# EAGLE design 主机 Microduino v1.0 (EAGLE 6.3)
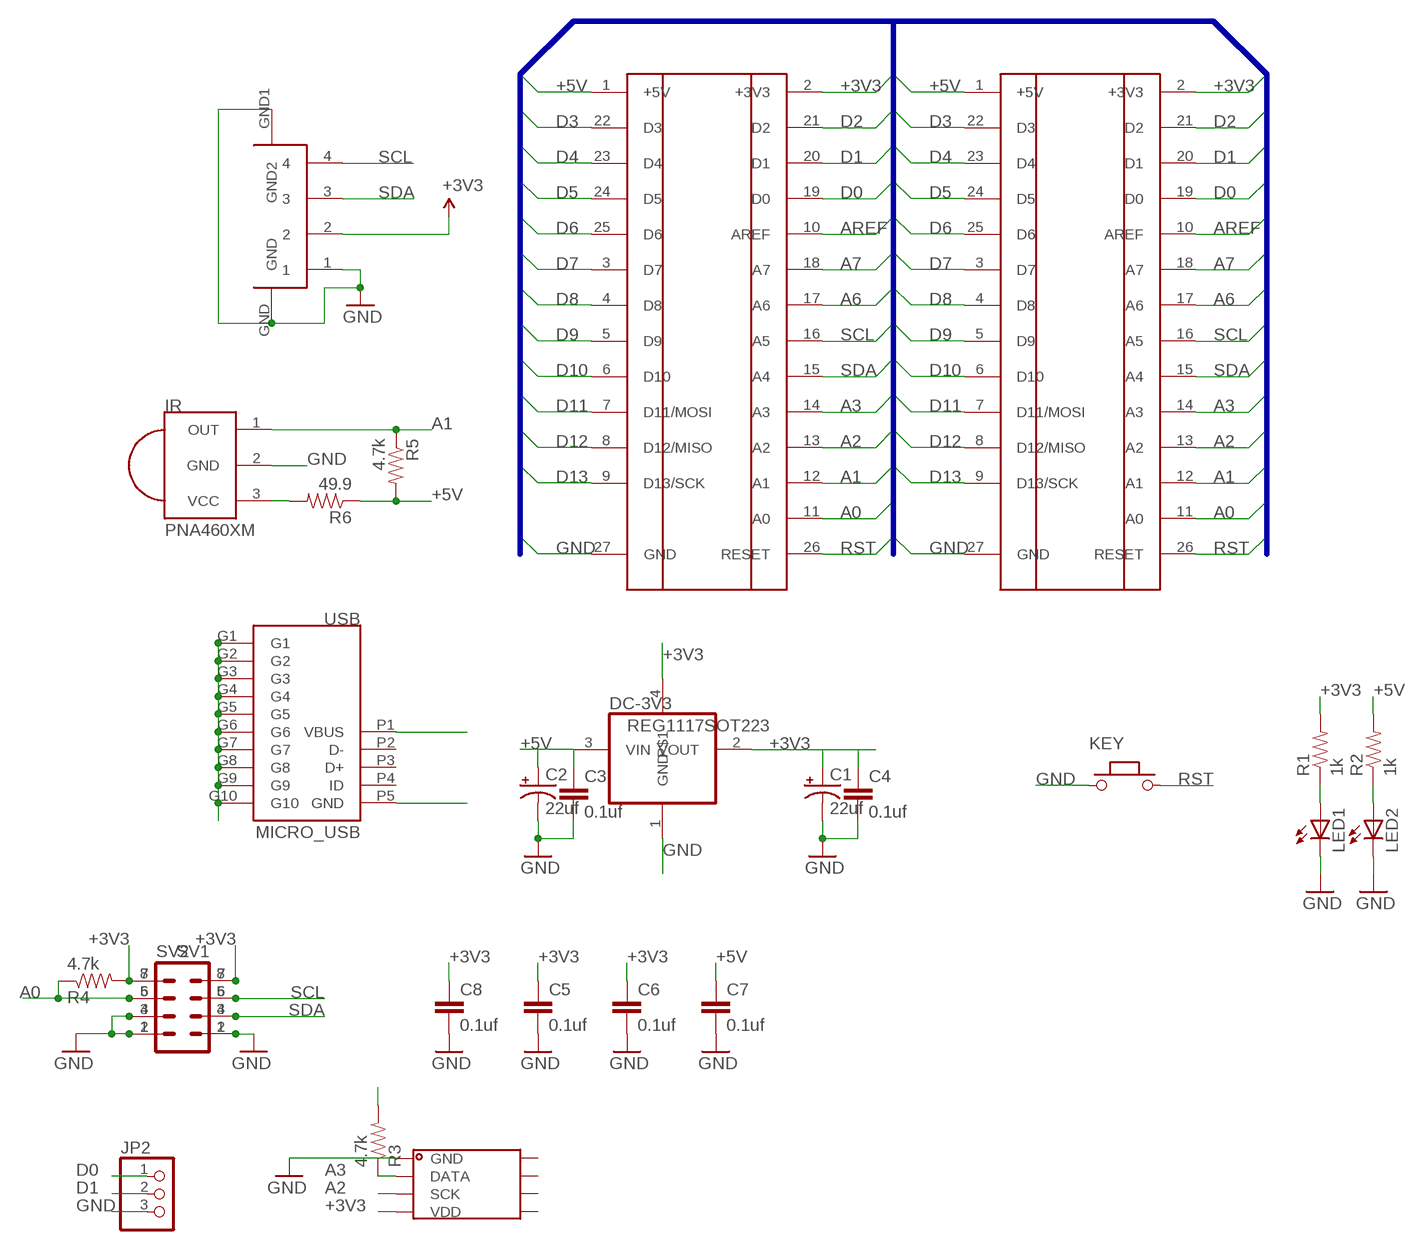
[diagram p0: schematic, sheet 1]

## Parts
C1  22uf  CAP_POL1206  [EIA3216]
C2  22uf  CAP_POL1206  [EIA3216]
C3  0.1uf  CAP0603-CAP  [0603-CAP]
C4  0.1uf  CAP0603-CAP  [0603-CAP]
C5  0.1uf  CAP0603-CAP  [0603-CAP]
C6  0.1uf  CAP0603-CAP  [0603-CAP]
C7  0.1uf  CAP0603-CAP  [0603-CAP]
C8  0.1uf  CAP0603-CAP  [0603-CAP]
DC-3V3  REG1117SOT223  [SOT223]
IR  PNA460XM  [PNA460XM]
JP2  PINHD-1X3  [1X03]
KEY  KEY-TES-018  [KEY-TS-018]
LED1  LED0805  [0805-LED]
LED2  LED0805  [0805-LED]
R1  1k  RESISTOR0603-RES  [0603-RES]
R2  1k  RESISTOR0603-RES  [0603-RES]
R3  4.7k  RESISTOR0603-RES  [0603-RES]
R4  4.7k  RESISTOR0603-RES  [0603-RES]
R5  4.7k  RESISTOR0603-RES  [0603-RES]
R6  49.9  RESISTOR0603-RES  [0603-RES]
SV1  MA04-2  [MA04-2]
SV2  MA04-2  [MA04-2]
U$1  PING-MICRDUINO/1009+  PING-MICRDUINO/1009  [PIN-MICRODUINO-1009]
U$2  PING-MICRDUINO/1009+  PING-MICRDUINO/1009  [PIN-MICRODUINO-1009]
U$3  S4B-XH-SM4-TB  [XH-SM4-TB]
U$4  SHT11  [SHT11]
USB  MICRO_USB  [MICRO_USB_LJ]

## Nets
+3V3: C1.A(+) C4.1 C5.1 C6.1 C8.1 DC-3V3.2(VOUT) DC-3V3.4 R1.2 R3.2 R4.2 SV1.7 SV1.8 SV2.7 SV2.8 U$1.2(+3V3) U$2.2(+3V3) U$3.2 U$4.4(VDD)
+5V: C2.A(+) C3.1 C7.1 DC-3V3.3(VIN) R2.2 R5.2 R6.1 U$1.1(+5V) U$2.1(+5V) USB.P1(VBUS)
A0: R4.1 SV1.5 SV2.6 U$1.11(A0) U$2.11(A0)
A1: IR.1(OUT) R5.1 U$1.12(A1) U$2.12(A1)
A2: U$1.13(A2) U$2.13(A2) U$4.3(SCK)
A3: R3.1 U$1.14(A3) U$2.14(A3) U$4.2(DATA)
A6: U$1.17(A6) U$2.17(A6)
A7: U$1.18(A7) U$2.18(A7)
AREF: U$1.10(AREF) U$2.10(AREF)
D0: JP2.1 U$1.19(D0) U$2.19(D0)
D1: JP2.2 U$1.20(D1) U$2.20(D1)
D2: U$1.21(D2) U$2.21(D2)
D3: U$1.22(D3) U$2.22(D3)
D4: U$1.23(D4) U$2.23(D4)
D5: U$1.24(D5) U$2.24(D5)
D6: U$1.25(D6) U$2.25(D6)
D7: U$1.3(D7) U$2.3(D7)
D8: U$1.4(D8) U$2.4(D8)
D9: U$1.5(D9) U$2.5(D9)
D10: U$1.6(D10) U$2.6(D10)
D11: U$1.7(D11/MOSI) U$2.7(D11/MOSI)
D12: U$1.8(D12/MISO) U$2.8(D12/MISO)
D13: U$1.9(D13/SCK) U$2.9(D13/SCK)
GND: C1.C(-) C2.C(-) C3.2 C4.2 C5.2 C6.2 C7.2 C8.2 DC-3V3.1(GND) IR.2(GND) JP2.3 KEY.2 LED1.C LED2.C SV1.1 SV1.2 SV1.3 SV2.1 SV2.2 SV2.4 U$1.27(GND) U$2.27(GND) U$3.1 U$3.GND U$3.GND1(GND2) U$4.1(GND) USB.G1 USB.G2 USB.G3 USB.G4 USB.G5 USB.G6 USB.G7 USB.G8 USB.G9 USB.G10 USB.P5(GND)
N$2: IR.3(VCC) R6.2
N$7: LED1.A R1.1
N$11: LED2.A R2.1
RST: KEY.1 U$1.26(RESET) U$2.26(RESET)
SCL: SV1.6 SV2.5 U$1.16(A5) U$2.16(A5) U$3.4
SDA: SV1.4 SV2.3 U$1.15(A4) U$2.15(A4) U$3.3
Unconnected: U$4.P$5 U$4.P$6 U$4.P$7 U$4.P$8 USB.P2(D-) USB.P3(D+) USB.P4(ID)

## Buses
B$1

## Library data of the parts
C1 C2 = microduino:CAP_POL: Capacitor Polarized These are standard SMD and PTH capacitors. Normally 10uF, 47uF, and 100uF in electrolytic and tantalum varieties. Always verify the external diameter of the through hole cap, it varies with capacity, voltage, and manufacturer. The EIA devices should be standard.
C3-C8 = microduino:CAP: Capacitor Standard 0603 ceramic capacitor, and 0.1" leaded capacitor.
DC-3V3 = 00my:REG1117
IR = adafruit:PNA460XM: IR 38KHz receiver PNA4602 and related receivers http://www.ladyada.net/library/pcb/eaglelibrary.html
JP2 = pinhead:PINHD-1X3: PIN HEADER
KEY = 00my:KEY
LED1 LED2 = 00my:LED: LEDs Standard schematic elements and footprints for 5mm, 3mm, 1206, and 0603 sized LEDs. 5mm - Spark Fun Electronics SKU : COM-00529 (and others)
R1 R2 = 00my:RESISTOR: Resistor Basic schematic elements and footprints for 0603, 1206, and PTH 1/10th watt (small) resistors.
R3-R6 = MY:RESISTOR: Resistor Basic schematic elements and footprints for 0603, 1206, and PTH 1/10th watt (small) resistors.
SV1 SV2 = pkj:MA04-2: PIN HEADER; OC_FARNELL: unknown; OC_NEWARK: unknown
U$1 U$2 = MY:PING-MICRDUINO: microduino引脚封装
U$3 = microduino:S4B-XH
U$4 = pkj:SHT11
USB = microduino:MICRO_USB

## Net classes
1 power: width 0.381 mm

## Board
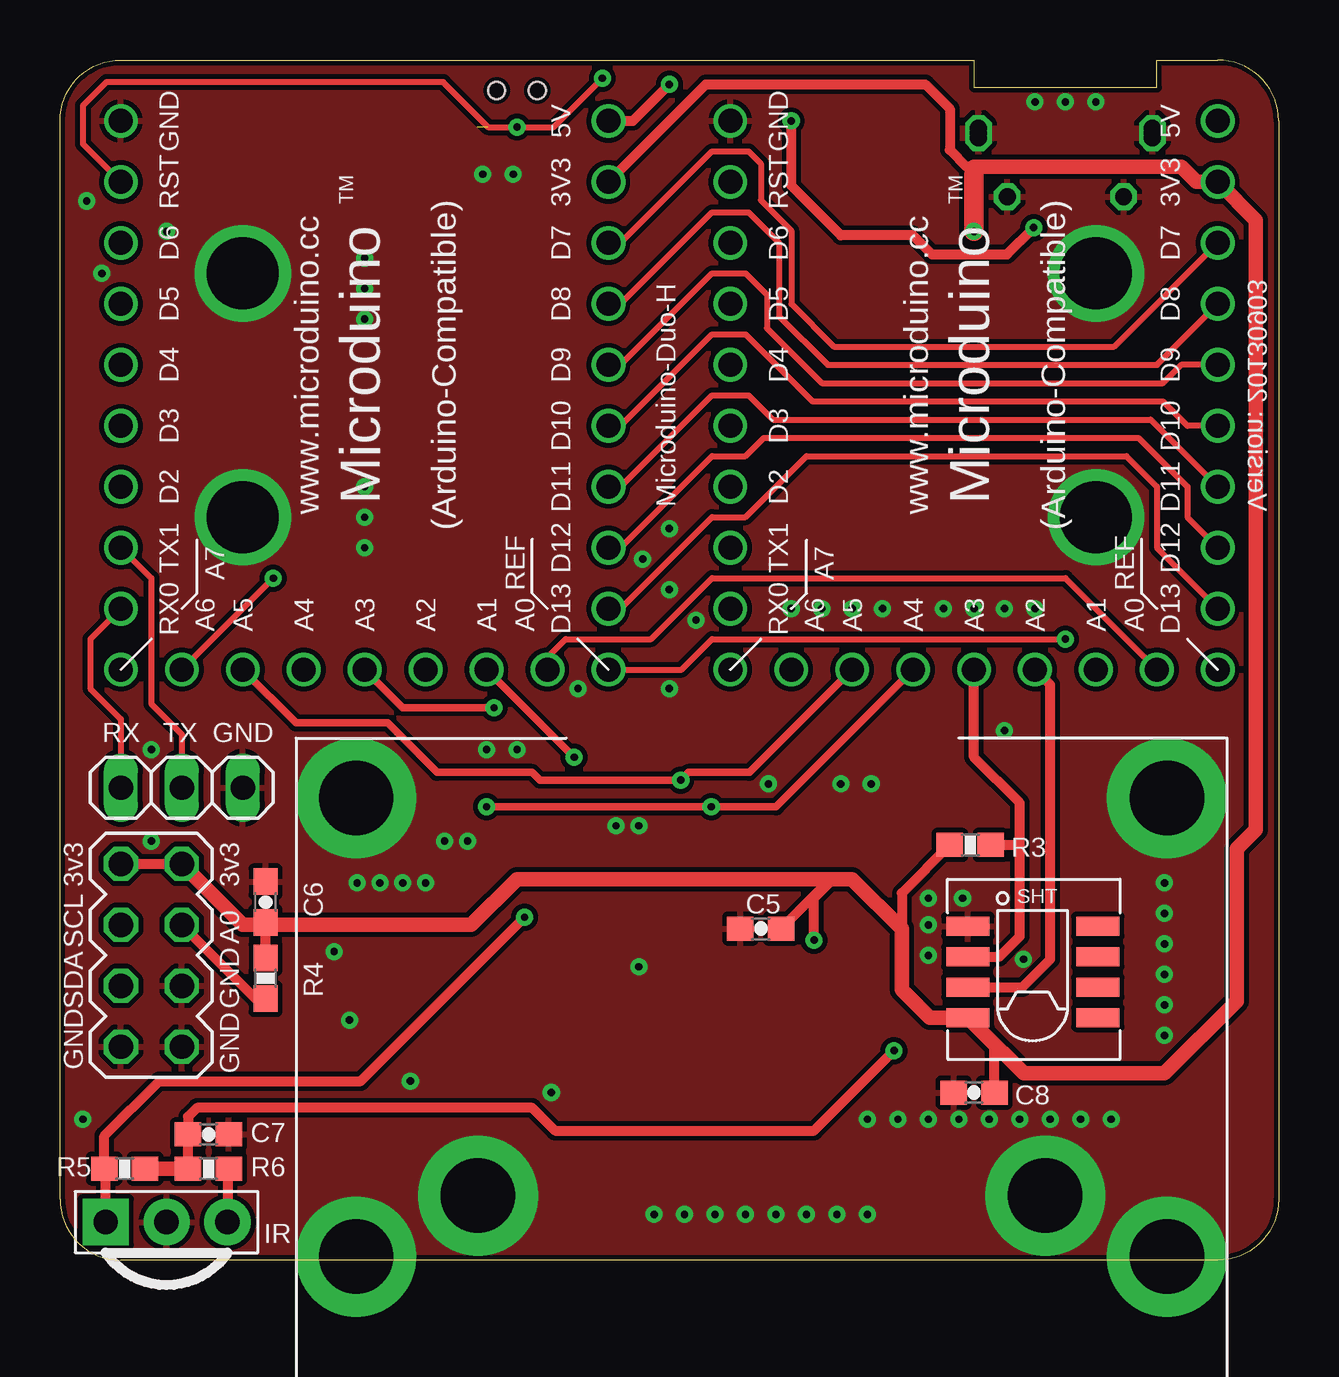
[diagram p1: board, top side]
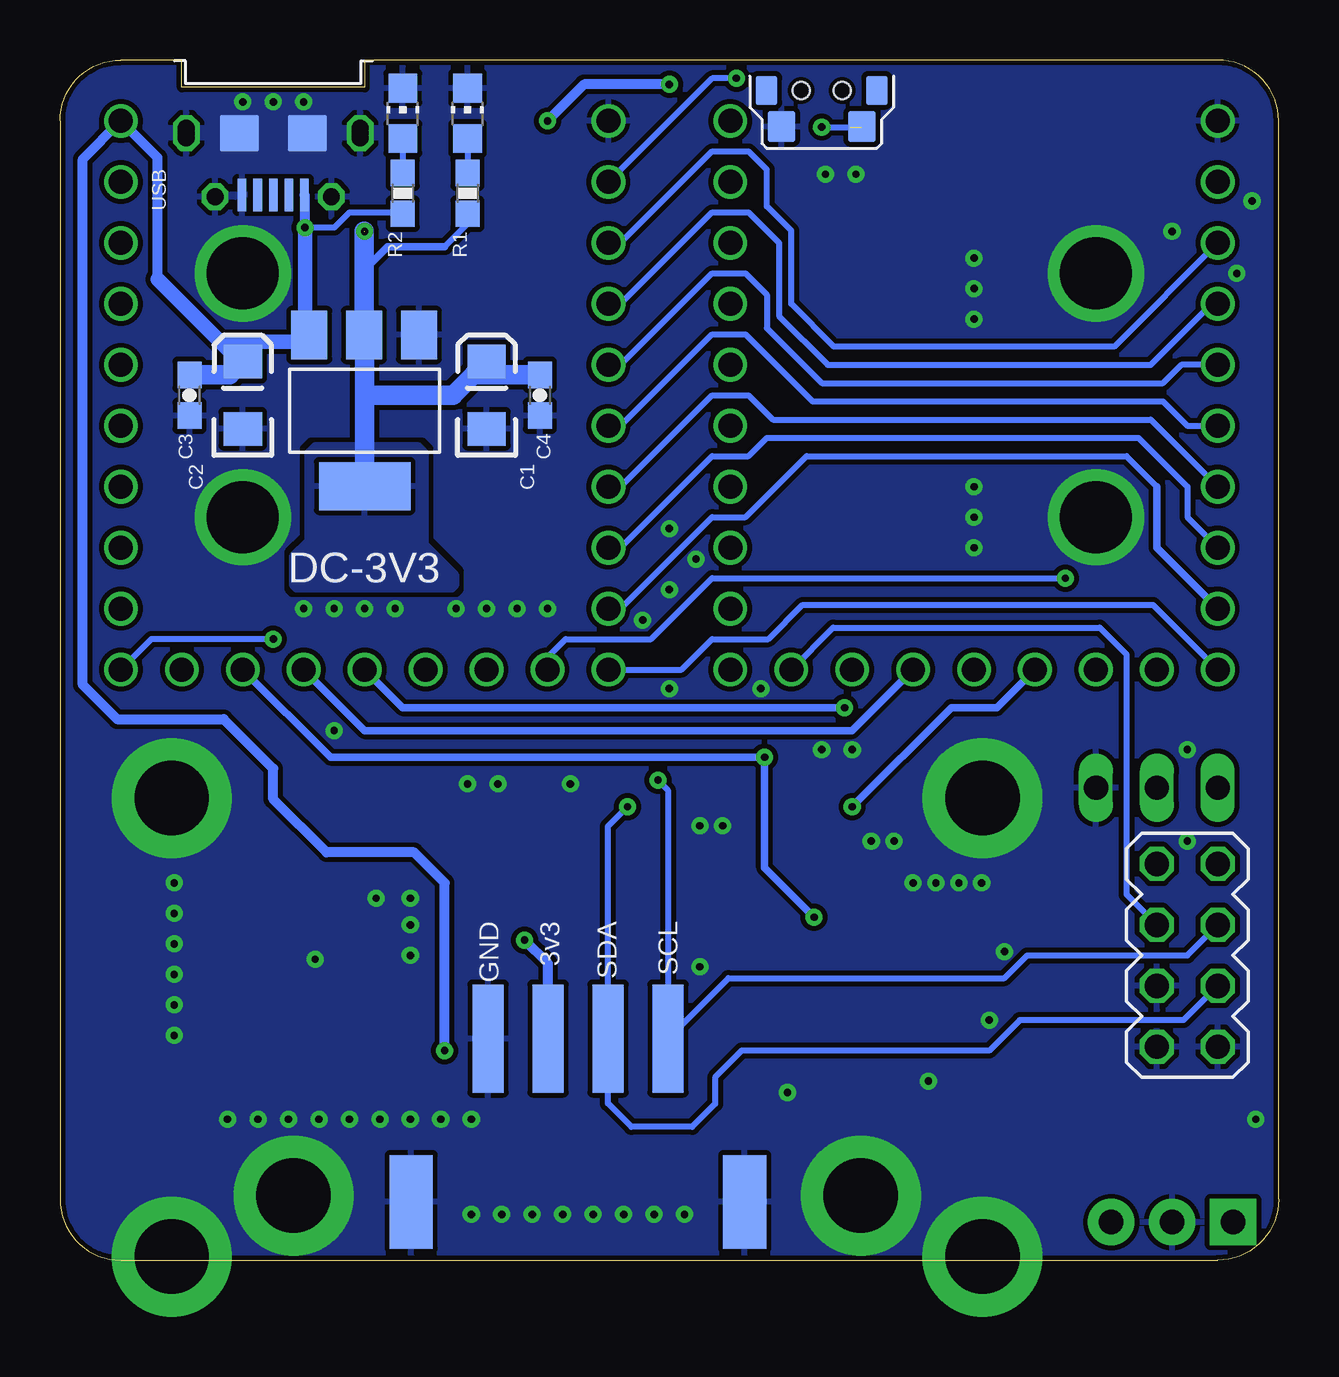
[diagram p2: board, bottom side, seen from below]

Size 50.8 x 50.01 mm. Coordinates in mm from the lower left corner, seen from the top.
Outline: 0,2.54 0,47.47 arc-90 2.54,50.01 38.1,50.01 38.1,48.86 45.72,48.86 45.72,50.01 48.26,50.01 arc-90 50.8,47.47 50.8,2.54 arc-90 48.26,0 2.54,0 arc-90 0,2.54
Copper layers (1*16): Top 0.035mm / dielectric 1.5mm / Bottom 0.035mm
Design rules "3d1": minimum track width 8mil, minimum drill 2mil, track to track 8mil, track to pad 8mil, pad to pad 8mil, via to via 8mil, smd to smd 0mil, copper to edge 8mil, drill to drill 8mil, minimum pad ring 8mil, minimum via ring 8mil, stop-mask expansion 2mil, vias tented up to drill 2mil, thermal gap 8mil

### Footprints (pad centres in the part's own frame; a part is rotated, then mirrored left to right if it is on the bottom)
EIA3216 = smd 1.4 x 1.6: A 1.4,0; C -1.4,0
0603-CAP = smd 1.1 x 1: 1 -0.85,0; 2 0.85,0
SOT223 = smd 1.499 x 2.007: 1 -2.261,-3.15; 2 0.025,-3.15; 3 2.311,-3.15 | smd 3.81 x 2.007: 4 0,3.15
PNA460XM = drill 1.016 pad 1.93 square: 1 -2.54,0 | drill 1.016 pad 1.93: 2 0,0; 3 2.54,0
1X03 = drill 1.016 long: 1 -2.54,0; 2 0,0; 3 2.54,0
KEY-TS-018 = smd 1.15 x 1.3: 1 1.675,-1.505; 2 -1.675,-1.505 | smd 0.9 x 1.2: 3 -2.3,0; 4 2.3,0 | hole 0.7: -0.85,0; 0.85,0
0805-LED = smd 1.2 x 1.2: A 0,-1.05; C 0,1.05
0603-RES = smd 1.1 x 1: 1 -0.85,0; 2 0.85,0
MA04-2 = drill 1.016 octagon: 1 -3.81,-1.27; 2 -3.81,1.27; 3 -1.27,-1.27; 4 -1.27,1.27; 5 1.27,-1.27; 6 1.27,1.27; 7 3.81,-1.27; 8 3.81,1.27
PIN-MICRODUINO-1009 = drill 1: 1 2.54,2.54; 2 5.08,2.54; 3 7.62,2.54; 4 10.16,2.54; 5 12.7,2.54; 6 15.24,2.54; 7 17.78,2.54; 8 20.32,2.54; 9 22.86,2.54; 10 25.4,2.54; 11 25.4,5.08; 12 25.4,7.62; 13 25.4,10.16; 14 25.4,12.7; 15 25.4,15.24; 16 25.4,17.78; 17 25.4,20.32; 18 25.4,22.86; 19 22.86,22.86; 20 20.32,22.86; 21 17.78,22.86; 22 15.24,22.86; 23 12.7,22.86; 24 10.16,22.86; 25 7.62,22.86; 26 5.08,22.86; 27 2.54,22.86
XH-SM4-TB = smd 1.3 x 4.5: 1 -3.75,8.75; 2 -1.25,8.75; 3 1.25,8.75; 4 3.75,8.75 | smd 1.8 x 3.9: GND -6.95,1.95; GND1 6.95,1.95
SHT11 = smd 1.8 x 0.8: 1 -6.445,-1.96; 2 -6.445,-3.23; 3 -6.445,-4.5; 4 -6.445,-5.77; P$5 -1.03,-5.77; P$6 -1.03,-4.5; P$7 -1.03,-3.23; P$8 -1.03,-1.96
MICRO_USB_LJ = drill 0.7 octagon: G1 -3.625,0.2; G2 -3.625,0; G3 -3.625,-0.2; G4 3.625,0.2; G5 3.625,0; G6 3.625,-0.2; G7 -2.425,2.65; G8 2.425,2.65 | smd 1.626 x 1.524: G9 -1.416,0; G10 1.416,0 | smd 0.4 x 1.35: P1 -1.3,2.575; P2 -0.65,2.575; P3 0,2.575; P4 0.65,2.575; P5 1.3,2.575

### Placement (x,y rotation side)
C1  33.02,36.04 90 bottom
C2  43.18,36.04 90 bottom
C3  45.4,36.04 270 bottom
C4  30.8,36.04 270 bottom
C5  29.21,13.81 180 top
C6  8.57,14.92 90 top
C7  6.19,5.24 0 top
C8  38.1,6.98 180 top
DC-3V3  38.1,35.4 180 bottom
IR  4.44,1.59 0 top
JP2  5.08,19.68 0 top
KEY  19.05,48.74 0 bottom
LED1  33.81,47.78 0 bottom
LED2  36.51,47.78 0 bottom
R1  33.81,44.45 270 bottom
R2  36.51,44.45 270 bottom
R3  37.94,17.3 180 top
R4  8.57,11.75 90 top
R5  2.7,3.81 0 top
R6  6.19,3.81 0 top
SV1  3.81,12.7 90 top
SV2  3.81,12.7 90 bottom
U$1  50.8,50.01 270 bottom
U$2  25.4,50.01 270 bottom
U$3  29.21,0.48 0 bottom
U$4  44.29,15.88 0 top
USB  41.91,46.96 180 bottom

### Tracks (layer width: path | path; a pad name or v marks a point on that pad's centre or on a via)
+3V3  (via drill 0.3)  (1 unrouted)
  Top 0.406: U$2.2 26.92,48.99 36.07,48.99 37.08,47.97 37.08,46.26 37.78,45.56 38.1,45.56 | SV1.8 SV1.7 | R4.2 C6.1 8.26,14.07 8.26,13.97 | C5.1 32.12,15.88 32.23,15.88 31.43,15.08 v31.43,13.34 | R3.2 35.08,15.3 35.08,12.54 | C8.1 38.95,9 38.34,9.61
  Top 0.61: 38.1,45.24 38.1,45.56 46.74,45.56 47.37,44.93 U$1.2 49.85,43.34 49.85,17.94 49.05,17.15 49.05,10.8 46.04,7.78 40.17,7.78 38.34,9.61 U$4.4 36.25,10.11 35.08,11.27 35.08,12.54 35.08,13.81 33.02,15.88 32.23,15.88 19.05,15.88 17.14,13.97 8.26,13.97 7.62,13.97 SV1.7
  Top 0.813: v38.1,42.86 38.1,45.24
  Bottom 0.254: R1.2 33.81,43.18 34.77,42.23
  Bottom 0.305: 34.77,42.23 37.15,42.23 37.94,41.43 38.12,41.43
  Bottom 0.406: DC-3V3.2 38.1,38.55 | U$3.2 30.46,12.36 v31.43,13.34
  Bottom 0.813: DC-3V3.2 38.12,41.43 38.12,42.86 | 38.1,38.55 38.1,36.04 | 38.1,36.04 DC-3V3.4 | C4.1 33.57,36.89 | C1.A 33.57,36.89 | 33.57,36.89 34.42,36.04 38.1,36.04
  pour Bottom (isolate 0.305, rank 5): 40.16,33.97 35.88,33.97 35.56,33.66 35.56,29.85 34.29,28.57 34.29,28.1 34.45,27.94 40.96,27.94 41.12,28.1 41.12,29.37 40.48,30 40.48,33.66
+5V  (via drill 0.3)
  Top 0.406: U$2.1 23.88,47.47 v25.4,48.99 | v40.59,43.02 39.48,41.91 36.35,41.91 35.56,42.7 32.54,42.7 30.48,44.77 v30.48,47.47 | R6.1 C7.1 5.34,5.98 5.71,6.35 19.68,6.35 20.64,5.4 31.43,5.4 v34.77,8.73
  Top 0.61: R6.1 R5.2
  Bottom 0.254: v40.59,43.02 39.37,43.02 38.73,43.66 37.05,43.66 R2.2
  Bottom 0.406: 46.74,40.86 46.74,45.94 U$1.1 49.85,45.88 49.85,23.97 48.42,22.54 43.97,22.54 41.91,20.48 41.91,19.21 39.69,16.99 36.04,16.99 34.77,15.72 v34.77,8.73 | 40.59,38.73 DC-3V3.3 | v25.4,48.99 28.96,48.99 v30.48,47.47 | v40.59,43.02 40.59,44.36 USB.P1
  Bottom 0.61: 44.13,38.26 46.74,40.86 | v40.59,43.02 40.59,38.73 | 44.13,38.26 40.7,38.26 DC-3V3.3 | 44.13,38.26 43.31,37.44 C2.A
  Bottom 0.813: C3.1 43.73,36.89 C2.A
A0
  Top 0.254: U$2.11 20.32,25.11 21.08,25.88 24.64,25.88 27.18,28.42 41.91,28.42 U$1.11
  Top 0.406: R4.1 8.15,10.9 SV1.5
  Bottom 0.254: U$2.11 18.57,26.35 7.46,26.35 6.35,25.24 6.35,15.24 SV1.5
A1  (via drill 0.3)
  Top 0.305: v21.43,20.96 U$2.12
  Top 0.406: IR.1 1.91,3.75 R5.1 1.85,5.18 4.13,7.46 12.54,7.46 v19.37,14.29
  Bottom 0.305: U$1.12 39.53,20.96 v21.43,20.96 21.43,16.35 v19.37,14.29
A2
  Top 0.406: U$4.3 40.11,11.38 41.27,12.54 41.27,23.97 U$1.13
  Bottom 0.305: U$2.13 17.78,22.07 38.1,22.07 U$1.13
A3  (via drill 0.3)
  Top 0.305: v18.1,23.02 14.29,23.02 U$2.14
  Top 0.406: U$4.2 39.16,12.65 40,13.49 40,17.3 | 40,17.3 40,19.05 38.1,20.96 U$1.14 | R3.1 40,17.3
  Bottom 0.305: U$1.14 36.51,23.02 v18.1,23.02
A6  (via drill 0.3)
  Top 0.254: v8.89,28.42 U$2.17
  Bottom 0.254: U$1.17 30.48,25.11 29.72,25.88 26.16,25.88 23.62,28.42 v8.89,28.42
A7
  Bottom 0.254: U$1.18 24.89,24.61 23.62,25.88 21.27,25.88 19.84,27.31 5.24,27.31 U$2.18
AREF  (via drill 0.3)
  Top 0.254: U$2.10 25.91,24.61 27.18,25.88 v41.91,25.88
  Bottom 0.254: v41.91,25.88 46.99,25.88 U$1.10
D0
  Top 0.254: U$2.19 1.27,25.88 1.27,23.81 2.54,22.54 JP2.1
  Bottom 0.254: U$1.19 27.43,27.15 23.62,30.96 22.22,30.96 19.68,33.5 6.35,33.5 5.08,32.23
  Bottom 0.305: U$2.19 5.08,29.69 5.08,32.23
D1
  Top 0.254: U$2.20 3.81,28.42 3.81,23.18 5.08,21.91 JP2.2
  Bottom 0.254: 27.43,29.69 23.62,33.5 22.1,33.5 21.34,34.26 5.84,34.26 3.81,32.23 3.81,30.96 U$2.20
  Bottom 0.305: U$1.20 27.43,29.69
D2
  Bottom 0.254: U$1.21 27.43,32.23 23.62,36.04 22.1,36.04 21.08,35.02 5.33,35.02 U$2.21
D3
  Bottom 0.254: U$1.22 27.43,34.77 23.62,38.58 22.22,38.58 19.43,35.78 4.83,35.78 3.81,34.77 U$2.22
D4
  Bottom 0.254: U$1.23 27.43,37.31 23.62,41.12 22.22,41.12 21.34,40.23 21.34,38.83 19.05,36.54 4.83,36.54 4.06,37.31 U$2.23
D5
  Bottom 0.254: U$1.24 27.43,39.85 23.62,43.66 22.1,43.66 20.83,42.39 20.83,39.34 18.8,37.31 5.33,37.31 2.79,39.85 U$2.24
D6
  Bottom 0.254: U$1.25 27.43,42.39 23.62,46.2 22.1,46.2 21.34,45.43 21.34,43.91 20.32,42.89 20.32,39.85 18.54,38.07 6.86,38.07 U$2.25
D7
  Top 0.254: U$2.3 23.37,42.39 27.18,46.2 28.7,46.2 29.21,45.69 29.21,44.16 30.48,42.89 30.48,39.85 32.26,38.07 43.94,38.07 U$1.3
D8
  Top 0.254: U$2.4 23.37,39.85 27.18,43.66 28.7,43.66 29.97,42.39 29.97,39.34 32,37.31 45.72,37.31 U$1.4
D9
  Top 0.254: U$2.5 23.37,37.31 27.18,41.12 28.57,41.12 29.46,40.23 29.46,38.83 31.75,36.54 45.97,36.54 46.74,37.31 U$1.5
D10
  Top 0.254: U$2.6 23.37,34.77 27.18,38.58 28.57,38.58 31.37,35.78 45.97,35.78 46.99,34.77 U$1.6
D11
  Top 0.254: U$2.7 23.37,32.23 27.18,36.04 28.7,36.04 29.72,35.02 45.47,35.02 U$1.7
D12
  Top 0.254: U$2.8 23.37,29.69 27.18,33.5 28.57,33.5 29.34,34.26 44.96,34.26 46.99,32.23 46.99,30.96 U$1.8
D13
  Top 0.254: U$2.9 23.37,27.15 27.18,30.96 28.57,30.96 31.12,33.5 44.45,33.5 45.72,32.23 45.72,29.69 U$1.9
GND  (via drill 0.3, 3, 3.1 pad 5)
  other vias: 7.62,30.96 12.7,29.69 43.18,30.96 7.62,41.12 12.7,40.48 43.18,41.12 12.7,39.21 12.7,41.75 12.7,30.96 12.7,32.23 38.1,27.15 39.37,27.15 36.83,27.15 34.29,27.15 33.02,27.15 31.75,27.15 30.48,27.15 40.64,27.15 41.91,48.26 43.18,48.26 40.64,48.26 12.34,19.25 12.34,0.15 46.14,0.15 46.14,19.25 46.04,15.72 46.04,14.45 46.04,13.18 46.04,11.91 46.04,10.64 46.04,9.37 33.66,1.9 32.38,1.9 31.12,1.9 29.84,1.9 28.57,1.9 27.3,1.9 26.04,1.9 24.77,1.9 25.4,27.94 24.29,29.21 25.4,30.48 26.51,26.67 25.4,23.81 41.06,2.69 17.42,2.69 43.81,5.87 42.55,5.87 41.27,5.87 40,5.87 38.73,5.87 37.46,5.87 36.2,5.87 34.92,5.87 33.66,5.87 20.48,6.98 12.38,15.72 3.81,21.27 13.34,15.72 3.81,17.46 15.24,15.72 0.95,5.87 4.44,42.86 39.37,22.07 21.59,23.81 14.29,15.72 1.11,44.13 16.03,17.46 17.62,45.24 18.89,45.24 32.54,19.84 33.81,19.84 14.61,7.46 23.18,18.1 24.13,18.1 24.13,12.22 12.07,10 16.99,17.46 11.43,12.86 1.75,41.12 40.16,12.54 17.78,21.27 19.05,21.27 29.53,19.84 37.62,15.08 36.2,15.08 36.2,13.97 36.2,12.7
  pour Top: 0,50.01 50.8,50.01 50.8,0 0,0
  pour Bottom (rank 6): 0,50.01 50.8,50.01 50.8,0 0,0
N$2
  Top 0.406: R6.2 6.99,4.03 IR.3
N$7
  Bottom 0.254: LED1.A R1.1
N$11
  Bottom 0.254: LED2.A R2.1
RST  (via drill 0.3)  (1 unrouted)
  Top 0.254: v22.61,49.24 20.57,47.21 17.84,47.21 15.97,49.09 1.94,49.09 0.95,48.1 0.95,46.51 U$2.26
  Bottom 0.254: U$1.26 23.62,49.24 v22.61,49.24 | v19.05,47.21 17.39,47.21 KEY.1
SCL  (via drill 0.3)
  Top 0.305: U$1.16 28.73,20.32 26.19,20.32 v25.88,20 20,20 19.68,20.32 15.72,20.32 13.65,22.38 9.84,22.38 U$2.16
  Bottom 0.254: SV1.6 3.81,12.7 10.48,12.7 11.43,11.75 22.94,11.75 U$3.4 25.46,19.59 v25.88,20
SDA  (via drill 0.3)
  Top 0.305: U$1.15 29.84,18.89 v27.15,18.89 v17.78,18.89
  Bottom 0.254: SV1.4 3.97,10 10.79,10 12.07,8.73 22.38,8.73 23.49,7.62 23.49,6.51 24.45,5.56 26.99,5.56 27.96,6.53 U$3.3 27.96,18.08 v27.15,18.89
  Bottom 0.305: v17.78,18.89 13.65,23.02 11.75,23.02 U$2.15

### Text on the board
tPlace: Microduino-Duo-H | Version: 20130903 | RX | TX | GND | 3v3 | 3v3 | SCL | A0 | SDA | GND | GND | GND
bPlace: SCL | SDA | 3v3 | GND